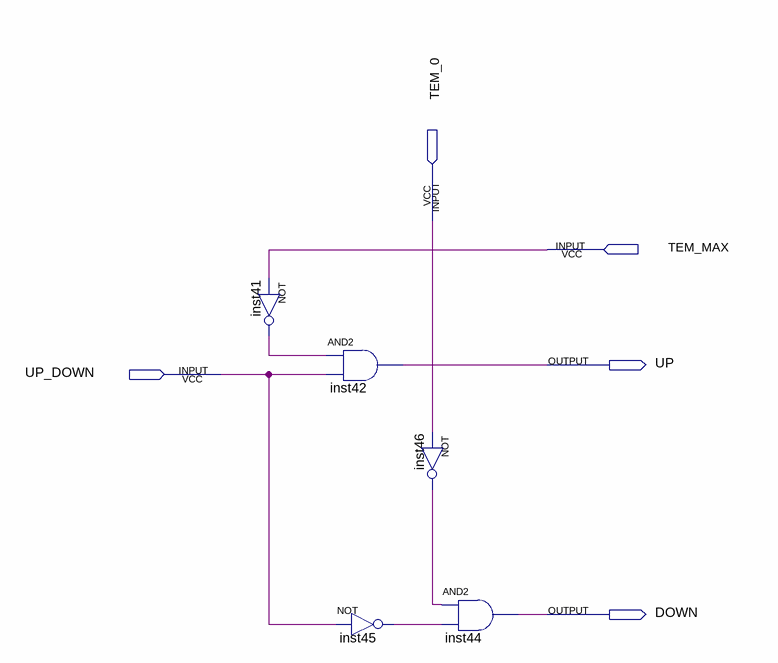
[diagram p0: schematic sheet]
// Quartus schematic limter.bdf as structural Verilog: 5 symbols, 5 pins
module limter (
  input  TEM_0,
  input  TEM_MAX,
  input  UP_DOWN,
  output UP,
  output DOWN
);

  wire inst41_out, inst45_out, inst46_out;

  not inst41 (inst41_out, TEM_MAX);
  and inst42 (UP, inst41_out, UP_DOWN);
  not inst45 (inst45_out, UP_DOWN);
  not inst46 (inst46_out, TEM_0);
  and inst44 (DOWN, inst46_out, inst45_out);
endmodule
